# Altium schematic sheet WIRING_DIAGRAM.SchDoc
size A4; SheetNumber: 12; SheetTotal: 12
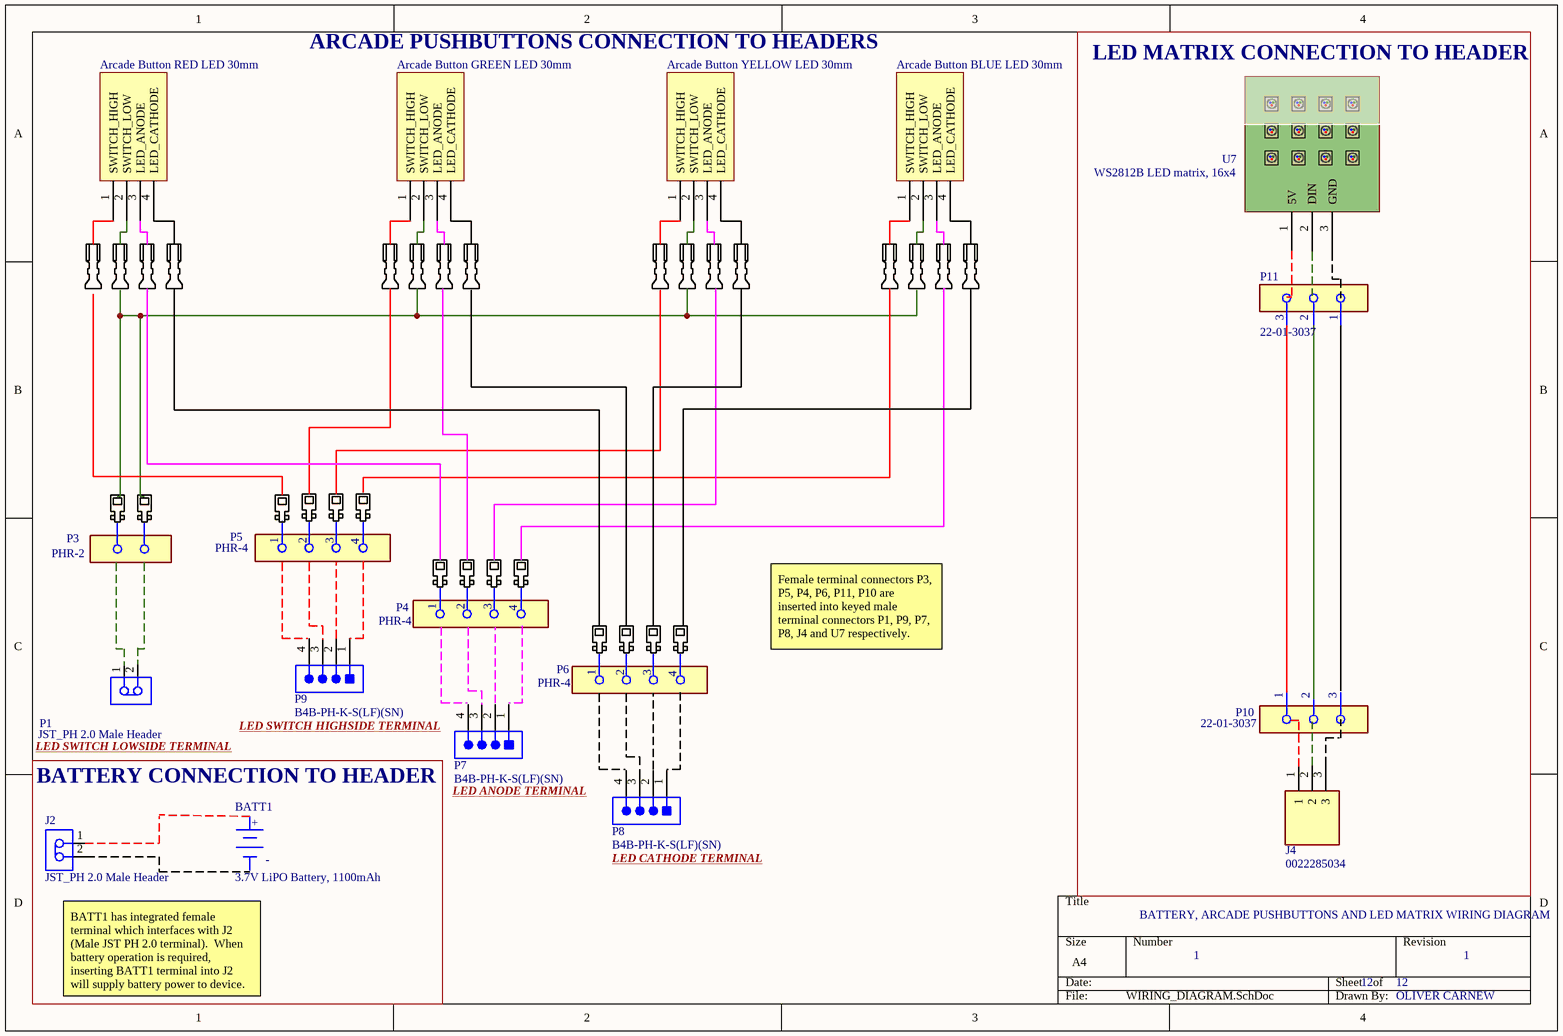
[diagram p0: WIRING_DIAGRAM.SchDoc]

## Parts
BATT1  3.7V LiPO Battery, 1100mAh  [FP-BR1225-MFG]
HW65  JST LTO-1.0T-110N-8  (value not drawn)
HW66  JST LTO-1.0T-110N-8  (value not drawn)
HW67  JST LTO-1.0T-110N-8  (value not drawn)
HW68  JST LTO-1.0T-110N-8  (value not drawn)
HW69  JST LTO-1.0T-110N-8  (value not drawn)
HW70  JST LTO-1.0T-110N-8  (value not drawn)
HW71  JST LTO-1.0T-110N-8  (value not drawn)
HW72  JST LTO-1.0T-110N-8  (value not drawn)
HW73  JST LTO-1.0T-110N-8  (value not drawn)
HW74  JST LTO-1.0T-110N-8  (value not drawn)
HW75  JST LTO-1.0T-110N-8  (value not drawn)
HW76  JST LTO-1.0T-110N-8  (value not drawn)
HW77  JST LTO-1.0T-110N-8  (value not drawn)
HW78  JST LTO-1.0T-110N-8  (value not drawn)
HW79  JST LTO-1.0T-110N-8  (value not drawn)
HW80  JST LTO-1.0T-110N-8  (value not drawn)
HW81  SPH-002T-P0.5S  (value not drawn)
HW82  SPH-002T-P0.5S  (value not drawn)
HW83  SPH-002T-P0.5S  (value not drawn)
HW84  SPH-002T-P0.5S  (value not drawn)
HW85  SPH-002T-P0.5S  (value not drawn)
HW86  SPH-002T-P0.5S  (value not drawn)
HW87  SPH-002T-P0.5S  (value not drawn)
HW88  SPH-002T-P0.5S  (value not drawn)
HW89  SPH-002T-P0.5S  (value not drawn)
HW90  SPH-002T-P0.5S  (value not drawn)
HW91  SPH-002T-P0.5S  (value not drawn)
HW92  SPH-002T-P0.5S  (value not drawn)
HW93  SPH-002T-P0.5S  (value not drawn)
HW94  SPH-002T-P0.5S  (value not drawn)
J2  JST_PH 2.0 Male Header  [JST-B2B-PH-K-S_V]
J4  0022285034  [0022285034]
P1  JST_PH 2.0 Male Header  [JST-B2B-PH-K-S_V]
P3  PHR-2  [FP-PHR-2-MFG]
P4  PHR-4  [FP-PHR-4-MFG]
P5  PHR-4  [FP-PHR-4-MFG]
P6  PHR-4  [FP-PHR-4-MFG]
P7  B4B-PH-K-S(LF)(SN)  [JST-B4B-PH-K-S_V]
P8  B4B-PH-K-S(LF)(SN)  [JST-B4B-PH-K-S_V]
P9  B4B-PH-K-S(LF)(SN)  [JST-B4B-PH-K-S_V]
P10  22-01-3037  [FP-22-01-3037-MFG]
P11  22-01-3037  [FP-22-01-3037-MFG]
PB5  Arcade Button RED LED 30mm
PB6  Arcade Button GREEN LED 30mm
PB7  Arcade Button YELLOW LED 30mm
PB8  Arcade Button BLUE LED 30mm
U7  WS2812B LED matrix, 16x4

## Blocks framed on the sheet
LED MATRIX CONNECTION TO HEADER: J4 P10 P11 U7
BATTERY CONNECTION TO HEADER: BATT1 J2

## Nets

Not connected (* = marked no-connect by the designer): J2 1 2; J4 1 2 3; P1 1 2; P7 1 2 3 4; P8 1 2 3 4; P9 1 2 3 4; PB5 1(SWITCH_HIGH) 2(SWITCH_LOW) 3(LED_ANODE) 4(LED_CATHODE); PB6 1(SWITCH_HIGH) 2(SWITCH_LOW) 3(LED_ANODE) 4(LED_CATHODE); PB7 1(SWITCH_HIGH) 2(SWITCH_LOW) 3(LED_ANODE) 4(LED_CATHODE); PB8 1(SWITCH_HIGH) 2(SWITCH_LOW) 3(LED_ANODE) 4(LED_CATHODE); U7 1(5V) 2(DIN) 3(GND)

## Notes on the sheet
- ARCADE PUSHBUTTONS CONNECTION TO HEADERS
- (near P11) 3
- (near P11) 2
- (near P11) 1
- Female terminal connectors P3, P5, P4, P6, P11, P10 are inserted into keyed male terminal connectors P1, P9, P7, P8, J4 and U7 respectively.
- (near P10) 1
- (near P10) 2
- (near P10) 3
- LED SWITCH LOWSIDE TERMINAL
- LED SWITCH HIGHSIDE TERMINAL
- LED ANODE TERMINAL
- LED CATHODE TERMINAL
- BATTERY, ARCADE PUSHBUTTONS AND LED MATRIX WIRING DIAGRAM
- BATT1 has integrated female terminal which interfaces with J2 (Male JST PH 2.0 terminal).  When battery operation is required, inserting BATT1 terminal into J2 will supply battery power to device.
- 1
- 12
- OLIVER CARNEW
- (in symbol CMP-05417-000012-1) +; -
- (in symbol CMP-17439-000059-1) 2; 3

## Library data of the parts
BATT1 = CMP-05417-000012-1: BATTERY LITHIUM 3V COIN 12.5MM; Manufacturer: Panasonic; Manufacturer Part Number: BR1225; ComponentLink2Description: Datasheet; Octopart: https://octopart.com/br1225-panasonic-39386830; Device Class L3: unset; Device Class L2: unset; ComponentLink2URL: https://industrial.panasonic.com/cdbs/www-data/pdf2/AAA4000/AAA4000C206.pdf; Temperature Range High: +80°C; Device Class L1: Passive Components; Mouser Description: Coin Cell Battery 3V 12 X 2.5 mm 48mA; Automotive: No; Category: Batt; Temperature Range Low: -30°C; Temperature: -30°C to +80°C; Digikey Description: BATTERY LITHIUM 3V COIN 12.5MM; Package: BR1225
HW65-HW80 = JST LTO-1.0T-110N-8: JST LTO Uninsulated Female Spade Connector / Receptacle / 2.8 x 0.5mm Tab Size
J2 P1 = CMP-2000-05162-1: Male Header, Pitch 2 mm, 1 x 2 Position, Height 6 mm, Tail Length 3.4 mm, -25 to 85 degC, RoHS, Bulk B2B-PH-K-S(LF)(SN); Manufacturer: JST; Pitch: 2mm; Style/Orientation: StraightHeader/Plug; No of Positions: 2; Datasheet Version: Nov-08; Datasheet URL: http://datasheet.octopart.com/B2B-PH-K-S%28LF%29%28SN%29-JST-datasheet-8324864.pdf; Manufacturer URL: http://www.jst.com/home2.html; Type: ShroudedHeader; Termination: Crimp
J4 = 0022285034: Connector; Manufacturer_Name: Molex; Datasheet Link: https://www.molex.com/content/dam/molex/molex-dot-com/products/automated/en-us/salesdrawingpdf/423/42375/022285034_sd.pdf?inline; Height: 10.67mm; Manufacturer_Part_Number: 0022285034; Arrow Part Number: 0022285034; Arrow Price/Stock: https://www.arrow.com/en/products/0022285034/molex?utm_currency=USD&region=nac
P3 = CMP-17439-000064-1: CONN HOUSING PH 2POS 2MM WHITE; Wire Gauge (Min): 24AWG; Number of Positions: 2; Gender: Female; Working Voltage: 100V; Contact Resistance: 10mR; Connector Type: Receptacle; Wire Gauge (Max): 30AWG; Max Current Rating: 2A; Insulation Resistance: 1GR; REACH SVHC: No SVHC; Contact Plating: Tin; Contact Type: Female Socket; Housing Material: Polyamide; Height: 6.4mm; Weight: 0.0625lb; Pitch: 2mm; Number of Rows: 1; Number of Contacts: 2; Mount: Free Hanging; Color: Natural; Lead Free: Lead Free; Max Operating Temperature: 85°C; Min Operating Temperature: -25°C; Length: 5.8mm; Depth: 6.85mm; Termination: Crimp; Number of Pins: 2; Max Voltage Rating (AC): 100V; Contact Material: Bronze; Housing Color: White; Current Rating: 2A; Fastening Type: Detent; Width: 4.5mm; Packaging: Bulk; Orientation: Straight; Series: PH; Flammability Rating: UL94 V-0; Material: Nylon
P4-P6 = CMP-17439-000059-1: CONN HOUSING PH 4POS 2MM WHITE; Insulation Resistance: 1GR; Gender: Receptacle; Contact Resistance: 10mR; Number of Contacts: 4; Working Voltage: 100V; Current Rating: 2A; Min Operating Temperature: -25°C; Flammability Rating: UL94 V-0; Pitch: 2mm; Contact Plating: Tin; Lead Free: Lead Free; Color: Natural; Depth: 6.85mm; Weight: 0.0625lb; Length: 9.8mm; Height: 6.4mm; Housing Material: Nylon; REACH SVHC: No SVHC; Termination: Crimp; Series: PH; Housing Color: Natural; Connector Type: Receptacle; Number of Rows: 1; Contact Type: Female Socket; Number of Positions: 4; Fastening Type: Detent; Width: 4.5mm; Packaging: Bulk; Orientation: Straight; Material: Nylon; Max Operating Temperature: 85°C; Number of Pins: 4; Contact Material: Bronze; Mount: Free Hanging
P7-P9 = CMP-2000-05165-1: Male Header, Pitch 2 mm, 1 x 4 Position, Height 6 mm, Tail Length 3.4 mm, -25 to 85 degC, RoHS, Bulk; Manufacturer: JST; No of Positions: 4; Style/Orientation: StraightHeader/Plug; Pitch: 2mm; Datasheet URL: http://datasheet.octopart.com/B4B-PH-K-S%28LF%29%28SN%29-JST-datasheet-10558886.pdf; Type: ShroudedHeader; Manufacturer URL: http://www.jst.com/home2.html; Termination: Crimp; Datasheet Version: Apr-09
P10 P11 = CMP-04776-000467-1: CONN HOUS 3POS .100 W/RAMP/RIB; Number of Circuits: 3; Max Current Rating: 4A; Glow Wire Compliant: Non-compliant; Gender: Female; Connector Type: Receptacle; Approvals: UL; Voltage Rating: 250V; Pitch: 2.54mm; Halogen Free: Low Halogen; Length: 8.18mm; Depth: 12.7mm; Housing Material: Nylon; Number of Rows: 1; Termination: Crimp; Height: 4.82mm; Orientation: Straight; Housing Color: White; Material: Nylon; Max Operating Temperature: 75°C; Fastening Type: Ramp; Radiation Hardening: No; Lead Free: Lead Free; Flammability Rating: UL94 V-0; Series: 2695; Min Operating Temperature: 0°C; Number of Contacts: 3; Packaging: Bulk; Contact Material: Bronze; Number of Positions: 3; Color: White; Contact Type: Non-Gendered; Mount: Free Hanging; Width: 4.82mm
PB5-PB8 = ARCADE_PUSHBUTTON: Ausleaf.
U7 = LED_MATRIX_CUTOFF